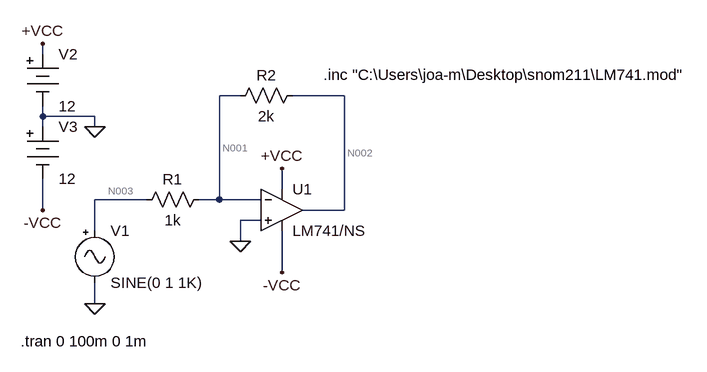
[diagram p0: schematic Draft2.asc]
Draft2.asc, the LTspice schematic file:
Version 4
SHEET 1 880 680
WIRE -256 -16 -256 -32
WIRE 48 48 16 48
WIRE 208 48 128 48
WIRE -256 80 -256 64
WIRE -176 80 -256 80
WIRE -256 96 -256 80
WIRE -176 96 -176 80
WIRE 112 192 112 160
WIRE -96 208 -176 208
WIRE 16 208 16 48
WIRE 16 208 -16 208
WIRE 80 208 16 208
WIRE -256 224 -256 176
WIRE 208 224 208 48
WIRE 208 224 144 224
WIRE 80 240 48 240
WIRE -176 256 -176 208
WIRE 48 272 48 240
WIRE 112 320 112 256
WIRE -176 368 -176 336
FLAG 112 160 +VCC
FLAG 112 320 -VCC
FLAG 48 272 0
FLAG -176 368 0
FLAG -176 96 0
FLAG -256 -32 +VCC
FLAG -256 224 -VCC
SYMBOL Opamps\\opamp2 112 160 R0
SYMATTR InstName U1
SYMATTR Value LM741/NS
SYMBOL Misc\\signal -176 240 R0
WINDOW 123 0 0 Left 2
WINDOW 39 0 0 Left 2
SYMATTR InstName V1
SYMBOL res 0 192 R90
WINDOW 0 0 56 VBottom 2
WINDOW 3 32 56 VTop 2
SYMATTR InstName R1
SYMATTR Value 1k
SYMBOL res 32 64 R270
WINDOW 0 32 56 VTop 2
WINDOW 3 0 56 VBottom 2
SYMATTR InstName R2
SYMATTR Value 2k
SYMBOL Misc\\battery -256 -32 R0
WINDOW 123 0 0 Left 2
WINDOW 39 0 0 Left 2
SYMATTR InstName V2
SYMATTR Value 12
SYMBOL Misc\\battery -256 80 R0
WINDOW 123 0 0 Left 2
WINDOW 39 0 0 Left 2
SYMATTR InstName V3
SYMATTR Value 12
TEXT 176 16 Left 2 !.inc "C:\\Users\\joa-m\\Desktop\\snom211\\LM741.mod"
TEXT -290 426 Left 2 !.tran 0 100m 0 1m

The netlist it stands for:
* Draft2.asc
XU1 0 N001 +VCC -VCC N002 LM741/NS  ; pins In+ In- V+ V- OUT
V1 N003 0 SINE(0 1 1K)
R1 N001 N003 1k
R2 N001 N002 2k
V2 +VCC 0 12
V3 0 -VCC 12
.inc "C:\Users\joa-m\Desktop\snom211\LM741.mod"
.tran 0 100m 0 1m
.backanno
.end

* Results of the author's LTspice run, read from the files saved beside the schematic
* Operating Point, zero values left out:
*   V(n001) = 1 mV
*   V(-vcc) = -12 V
*   V(+vcc) = 12 V
*   V(n002) = 3.204 mV
*   I(R2) = -1.102 µA
*   I(R1) = 1 µA
*   I(V3) = -1.626 mA
*   I(V2) = -1.627 mA
*   I(V1) = 1 µA
*   Ix(u1:1) = 57.86 nA
*   Ix(u1:2) = 101.9 nA
*   Ix(u1:99) = 1.627 mA
*   Ix(u1:50) = -1.626 mA
*   Ix(u1:28) = -1.102 µA
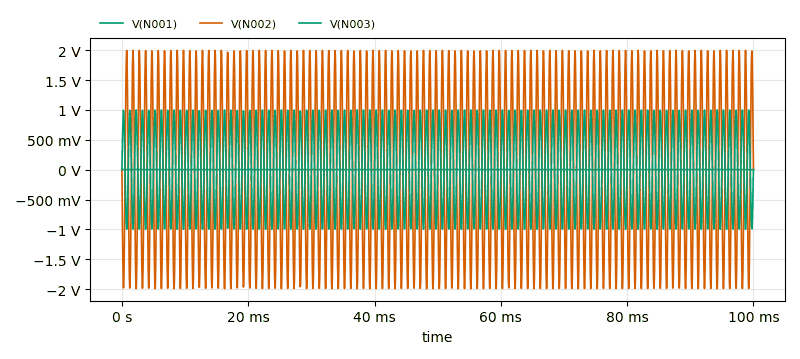
[diagram p1: Transient Analysis of Draft2.asc, plotted from the saved traces]
* Transient Analysis, 1 run:
*   V(N001): min -1.14 mV, max 3.201 mV, average 994.5 µV, rms 1.77 mV, last 3.201 mV
*   V(N002): min -1.996 V, max 1.998 V, average -1.263 mV, rms 1.405 V, last 9.823 mV
*   V(N003): min -997.7 mV, max 999.5 mV, average 2.225 mV, rms 702.4 mV, last 0 V